# Altium schematic sheet 08-LogicNAND.SchDoc
size A4; DocumentNumber: 8; SheetNumber: 8; SheetTotal: 26
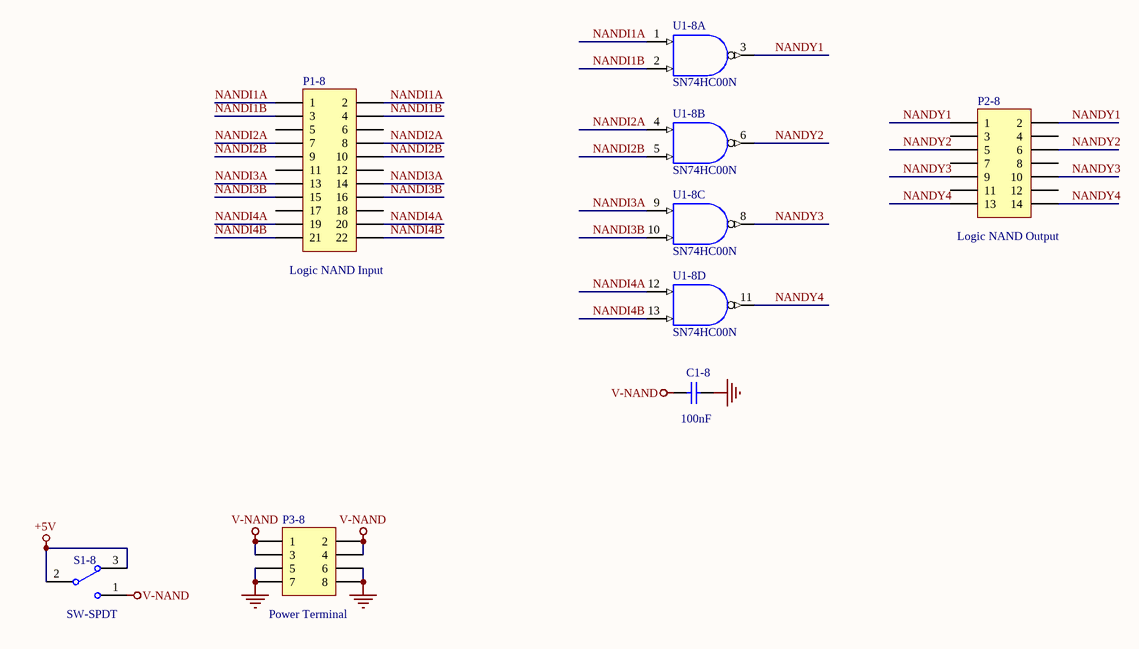
[diagram p0: 08-LogicNAND.SchDoc]

## Parts
C1-8  value 100nF  [c-0805]  (hidden comment: 104)
P1-8  value Logic NAND Input  [JP2.54-F-2x11A]  (hidden comment: Header 11X2)
P2-8  value Logic NAND Output  [JP2.54-F-2x07A]  (hidden comment: H7X2)
P3-8  Publisher: Power Terminal  [JP2.54-F-2x04A]  (hidden comment: Header 4X2)
S1-8  SW-SPDT  [SW-SLIDE-2P-2W]
U1-8  SN74HC00N  [SK-DIP14-300]  (parts A,B,C,D of 4)

## Nets
+5V: S1-8.2 S1-8.3
GND: C1-8.2 P3-8.5 P3-8.6 P3-8.7 P3-8.8 U1-8.7(GND)
V-NAND: C1-8.1 P3-8.1 P3-8.2 P3-8.3 P3-8.4 S1-8.1 U1-8.14(V-NAND)
NANDI1A: P1-8.1 P1-8.2 U1-8.1(A)
NANDI1B: P1-8.3 P1-8.4 U1-8.2(B)
NANDI2A: P1-8.7 P1-8.8 U1-8.4(A)
NANDI2B: P1-8.9 P1-8.10 U1-8.5(B)
NANDI3A: P1-8.13 P1-8.14 U1-8.9(A)
NANDI3B: P1-8.15 P1-8.16 U1-8.10(B)
NANDI4A: P1-8.19 P1-8.20 U1-8.12(A)
NANDI4B: P1-8.21 P1-8.22 U1-8.13(B)
NANDY1: P2-8.1 P2-8.2 U1-8.3(Y)
NANDY2: P2-8.5 P2-8.6 U1-8.6(Y)
NANDY3: P2-8.9 P2-8.10 U1-8.8(Y)
NANDY4: P2-8.13 P2-8.14 U1-8.11(Y)

Not connected (* = marked no-connect by the designer): P1-8 5 6 11 12 17 18; P2-8 3 4 7 8 11 12

## Library data of the parts
C1-8 = Cap: Capacitor; Published: 8-Jun-2000; LatestRevisionDate: 17-Jul-2002; LatestRevisionNote: Re-released for DXP Platform.; PackageReference: RAD-0.3; Publisher: Altium Limited; PackageDescription: Radial Cap, Thru-Hole; 2 Leads; 0.3 in Pin Spacing
P1-8 = Header 11X2: Header, 11-Pin, Dual row; LatestRevisionDate: 17-Jul-2002; LatestRevisionNote: Re-released for DXP Platform.
P2-8 = Header 7X2: Header, 7-Pin, Dual row; LatestRevisionDate: 17-Jul-2002; LatestRevisionNote: Re-released for DXP Platform.
P3-8 = Header 4X2: Header, 4-Pin, Dual row; LatestRevisionDate: 17-Jul-2002; LatestRevisionNote: Re-released for DXP Platform.
S1-8 = SW-SPDT: SPDT Subminiature Toggle Switch, Right Angle Mounting, Vertical Actuation; Published: 24-Mar-1999; LatestRevisionDate: 17-Dec-2003; LatestRevisionNote: Schematic revised, PCB Footprint replaced.; DatasheetVersion: 05-Dec-2000; PackageReference: TL36WW15050; Publisher: Altium Limited; PackageDescription: Switch; 4 Leads; ComponentLink1Description: Manufacturer Link; ComponentLink1URL: http://www.apem.com
U1-8 = SN74HC00N: Quadruple 2-Input Positive-NAND Gate; Published: 8-Jun-2000; LatestRevisionDate: 04-Mar-2005; LatestRevisionNote: Stylized 3D Model Added.; DatasheetVersion: May-1997; PackageVersion: Oct-1995; PackageReference: N014; Publisher: Altium Limited; PackageDescription: DIP; 14 Leads; Row Spacing 7.62 mm; Pitch 2.54 mm; ComponentLink1Description: Manufacturer Link; ComponentLink1URL: http://www.ti.com/; ComponentLink2Description: Datasheet; ComponentLink2URL: http://www-s.ti.com/sc/ds/sn74hc00.pdf